# EAGLE design BBLeo_v1.1 (EAGLE 6.3)
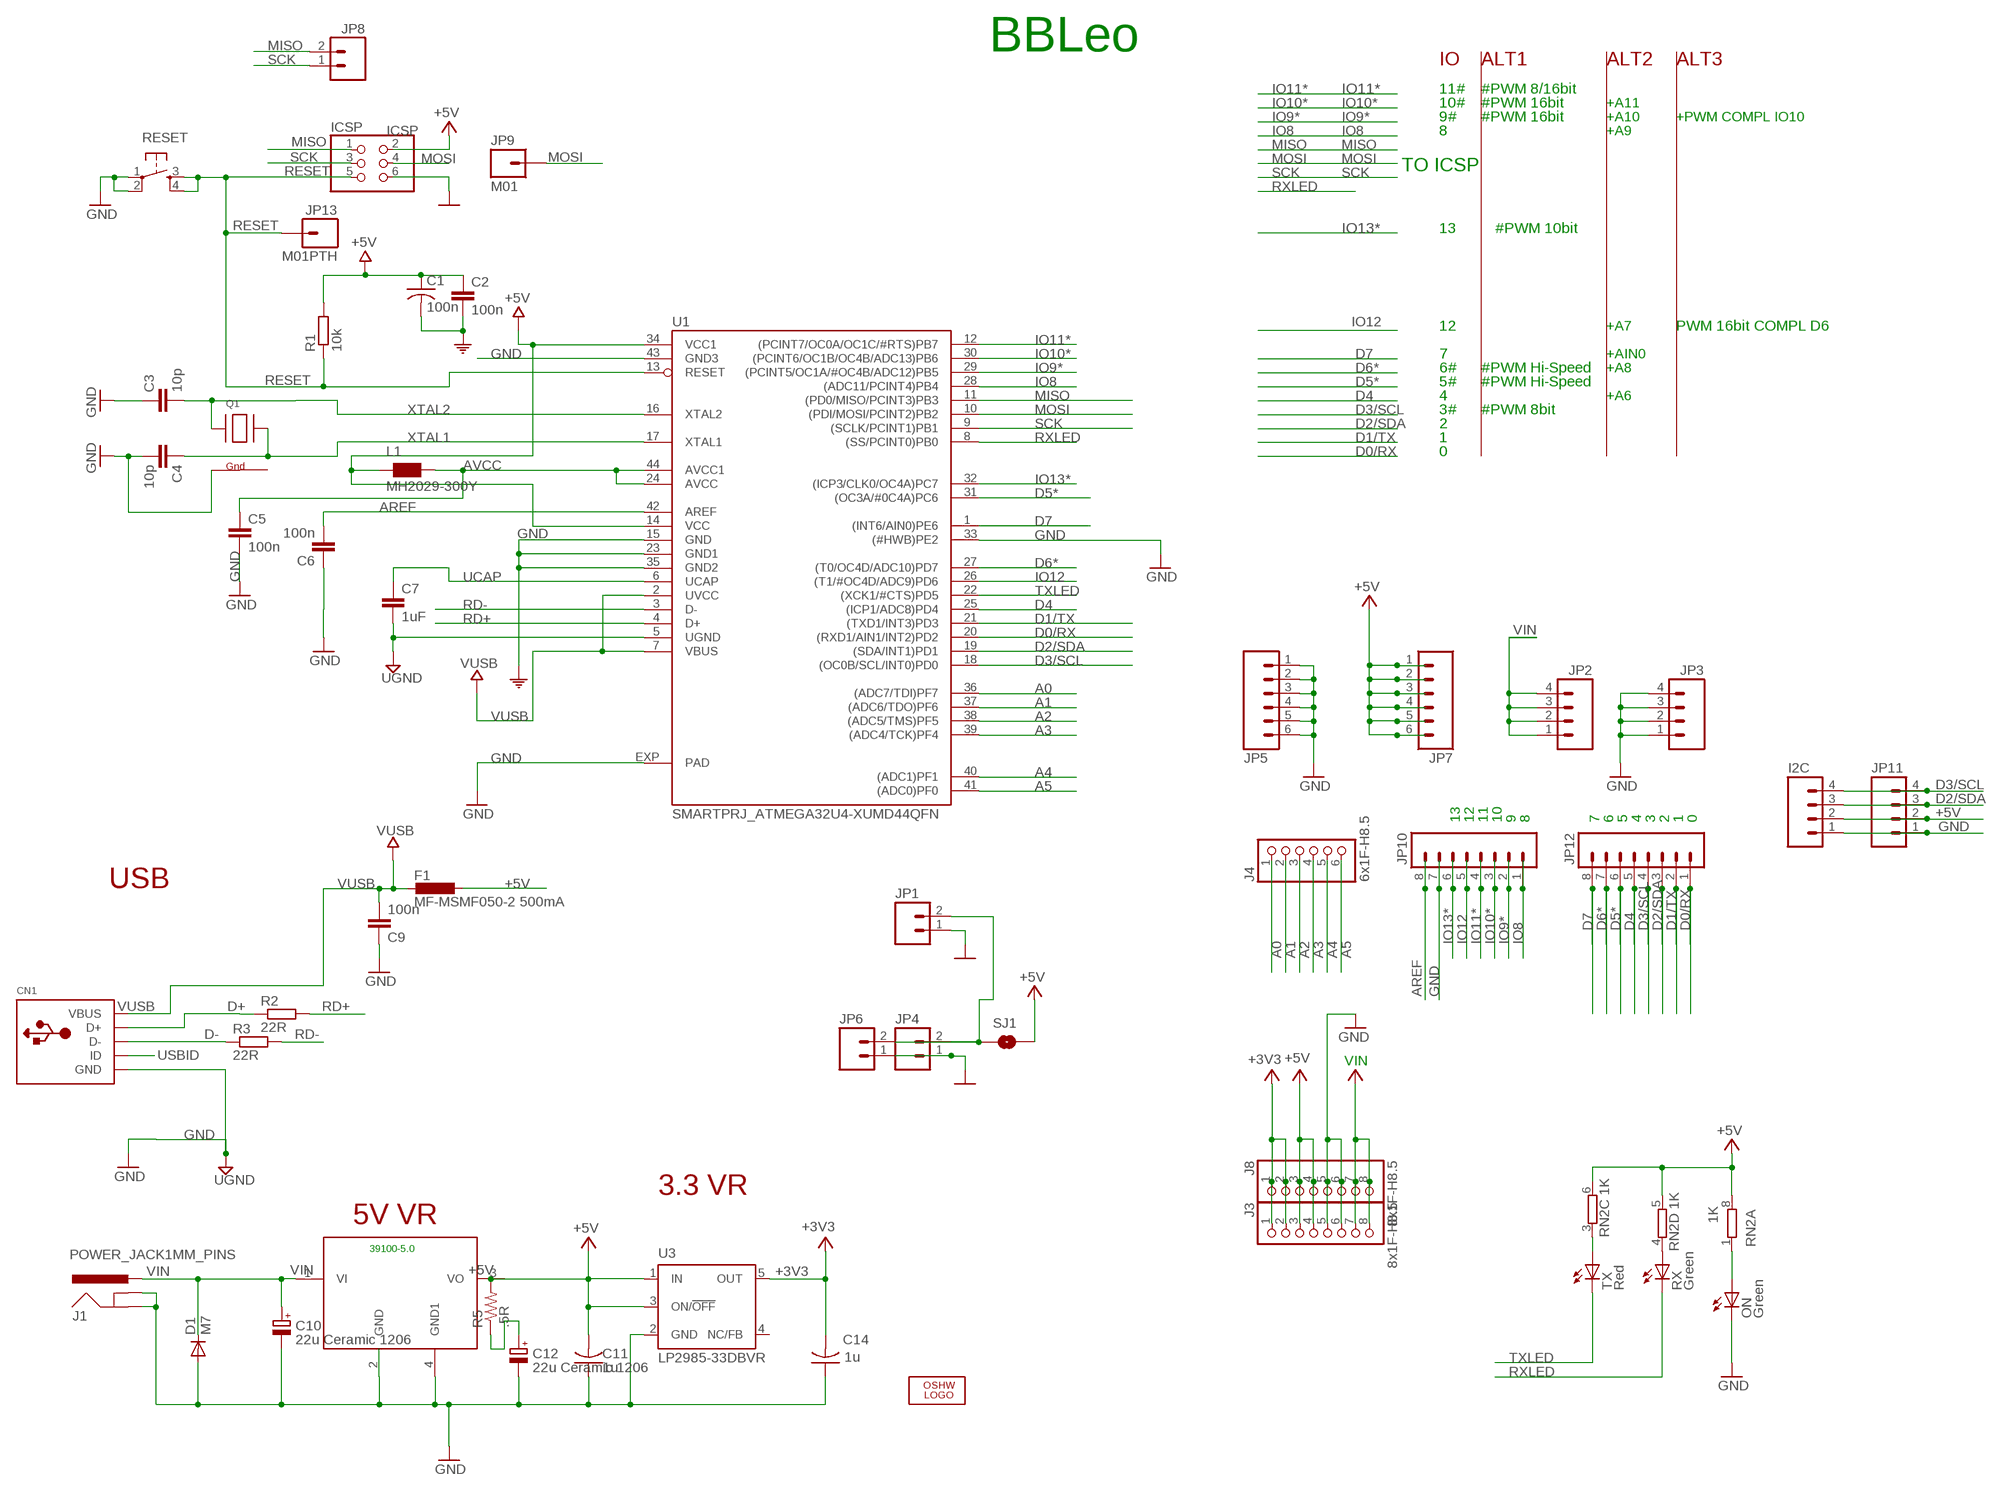
[diagram p0: schematic, sheet 1]

## Parts
C1  100n  C-USC0603K  [C0603K]
C2  100n  C-EUC0603  [C0603-ROUND]
C3  10p  C-EUC0603  [C0603-ROUND]
C4  10p  C-EUC0603  [C0603-ROUND]
C5  100n  C-EUC0603  [C0603-ROUND]
C6  100n  C-EUC0603  [C0603-ROUND]
C7  1uF  C-EUC0603  [C0603-ROUND]
C9  100n  C-EUC0603  [C0603-ROUND]
C10  22u Ceramic 1206  CPOL-EUSMCB  [SMC_B]
C11  1u  C-USC0603K  [C0603K]
C12  22u Ceramic 1206  CPOL-EUSMCB  [SMC_B]
C14  1u  C-USC0603K  [C0603K]
CN1  USBMINIB  [USB-MINIB]
D1  M7  DIODE-SMB  [SMB]
F1  MF-MSMF050-2 500mA  L-EUL1812  [L1812]
I2C  M04SQ_SILK  [1X04_SQ_SILK]
IC1  MIC39100DB  [SOT223WTAB]
ICSP  ICSP  PINHD-2X3  [2X03]
J1  POWER_JACK1MM_PINS  [POWER_JACK_1MMPTH.PAC]
J3  8x1F-H8.5  PINHD-1X8  [1X08]
J4  6x1F-H8.5  PINHD-1X6  [1X06]
J8  8x1F-H8.5  PINHD-1X8  [1X08]
JP1  M02PTH  [1X02]
JP2  M04SQ_SILK  [1X04_SQ_SILK]
JP3  M04SQ_SILK  [1X04_SQ_SILK]
JP4  M02PTH  [1X02]
JP5  M06SQ_SILK  [1X06_SQ_SILK]
JP6  M02PTH  [1X02]
JP7  M06SQ_SILK  [1X06_SQ_SILK]
JP8  M02PTH  [1X02]
JP9  M01  M01PTH  [1X01]
JP10  M08  [1X08]
JP11  M04SQ_SILK  [1X04_SQ_SILK]
JP12  M08  [1X08]
JP13  M01PTH  [1X01]
L1  MH2029-300Y  WE-CBF_0805  [0805]
LOGO1  OSHW_LOGO_FILLX0100-NT  [OSHW_FILLX100_NOTEXT]
ON  Green  LEDCHIPLED_0805  [CHIPLED_0805]
Q1  XTAL-4-3225  [NX3225]
R1  10k  R-EU_R0603  [R0603]
R2  22R  R-EU_R0603  [R0603]
R3  22R  R-EU_R0603  [R0603]
R5  .5R  R-US_R0603  [R0603]
RESET  6MM_SWITCH6MM_SWITCH  [6MM_SWITCH]
RN2  1K  4R-NCAY16  [CAY16]
RX  Green  LEDCHIPLED_0805  [CHIPLED_0805]
SJ1  SOLDERJUMPERNC2  [SJ_2S-NOTRACE]
TX  Red  LEDCHIPLED_0805  [CHIPLED_0805]
U1  SMARTPRJ_ATMEGA32U4-XUMD44QFN  [MD__QFN44ML7X7]
U3  LP2985-33DBVR  LP2985-XXDBVR33  [SOT23-DBV]

## Nets
+3V3: C14.2 J3.1 J3.2 J8.1 J8.2 U3.5(OUT)
+5V [usbvcc]: C1.1 C2.1 C11.2 F1.1 I2C.2 IC1.3(VO) ICSP.2 J3.3 J3.4 J8.3 J8.4 JP7.1 JP7.2 JP7.3 JP7.4 JP7.5 JP7.6 JP11.2 L1.1 R1.2 R5.2 RN2.5 RN2.6 RN2.8 SJ1.2 U1.14(VCC) U1.34(VCC1) U3.1(IN) U3.3(ON/!OFF)
A0: J4.1 U1.36((ADC7/TDI)PF7)
A1: J4.2 U1.37((ADC6/TDO)PF6)
A2: J4.3 U1.38((ADC5/TMS)PF5)
A3: J4.4 U1.39((ADC4/TCK)PF4)
A4: J4.5 U1.40((ADC1)PF1)
A5: J4.6 U1.41((ADC0)PF0)
AREF [aref]: C6.2 JP10.8 U1.42(AREF)
AVCC: C5.1 L1.2 U1.24(AVCC) U1.44(AVCC1)
D0/RX: JP12.1 U1.20((RXD1/AIN1/INT2)PD2)
D1/TX: JP12.2 U1.21((TXD1/INT3)PD3)
D2/SDA: I2C.3 JP11.3 JP12.3 U1.19((SDA/INT1)PD1)
D3/SCL: I2C.4 JP11.4 JP12.4 U1.18((OC0B/SCL/INT0)PD0)
D4: JP12.5 U1.25((ICP1/ADC8)PD4)
D5*: JP12.6 U1.31((OC3A/#0C4A)PC6)
D6*: JP12.7 U1.27((T0/OC4D/ADC10)PD7)
D7: JP12.8 U1.1((INT6/AIN0)PE6)
D+: CN1.D+ R2.1
D-: CN1.D- R3.1
GND [gnd]: C1.2 C2.2 C3.1 C4.2 C5.2 C6.1 C9.1 C10.- C11.1 C12.- C14.1 CN1.GND D1.A I2C.1 IC1.2(GND) IC1.4(GND1) ICSP.6 J1.GND J1.GNDBREAK J3.5 J3.6 J8.5 J8.6 JP1.1 JP3.1 JP3.2 JP3.3 JP3.4 JP4.1 JP5.1 JP5.2 JP5.3 JP5.4 JP5.5 JP5.6 JP6.1 JP10.7 JP11.1 ON.C Q1.4(G1) RESET.1(P) RESET.2(P1) U1.15(GND) U1.23(GND1) U1.33((#HWB)PE2) U1.35(GND2) U1.43(GND3) U1.EXP(PAD) U3.2(GND) ; supply symbol labelled , COM, UGND
GND1: C7.2 U1.5(UGND) ; supply symbol labelled UGND
IO8: JP10.1 U1.28((ADC11/PCINT4)PB4)
IO9*: JP10.2 U1.29((PCINT5/OC1A/#OC4B/ADC12)PB5)
IO10*: JP10.3 U1.30((PCINT6/OC1B/OC4B/ADC13)PB6)
IO11*: JP10.4 U1.12((PCINT7/OC0A/OC1C/#RTS)PB7)
IO12: JP10.5 U1.26((T1/#OC4D/ADC9)PD6)
IO13*: JP10.6 U1.32((ICP3/CLK0/OC4A)PC7)
MISO: ICSP.1 JP8.2 U1.11((PD0/MISO/PCINT3)PB3)
MOSI: ICSP.4 JP9.1 U1.10((PDI/MOSI/PCINT2)PB2)
N$2: RN2.3 TX.A
N$3: ON.A RN2.1
N$4: C12.+ R5.1
N$5: RN2.4 RX.A
RD+: R2.2 U1.4(D+)
RD-: R3.2 U1.3(D-)
RESET: ICSP.5 JP13.1 R1.1 RESET.3(S) RESET.4(S1) U1.13(RESET)
RXLED: RX.C U1.8((SS/PCINT0)PB0)
S5V: JP1.2 JP4.2 JP6.2 SJ1.1
SCK: ICSP.3 JP8.1 U1.9((SCLK/PCINT1)PB1)
TXLED: TX.C U1.22((XCK1/#CTS)PD5)
UCAP: C7.1 U1.6(UCAP)
USBID: CN1.ID
VIN [power]: C10.+ D1.C IC1.1(VI) J1.PWR J3.7 J3.8 J8.7 J8.8 JP2.1 JP2.2 JP2.3 JP2.4 ; supply symbol labelled V+
VUSB [power]: C9.2 CN1.VBUS F1.2 U1.2(UVCC) U1.7(VBUS)
XTAL1: C4.1 Q1.3(X2) U1.17(XTAL1)
XTAL2: C3.2 Q1.1(X1) U1.16(XTAL2)
Unconnected: RN2.2 RN2.7 U3.4(NC/FB)

## Notes on the sheet
- BBLeo
- IO | ALT1 | ALT2 | ALT3
- 11# | #PWM 8/16bit
- 10# | #PWM 16bit | +A11
- 9# | #PWM 16bit | +A10 | +PWM COMPL IO10
- 8 | +A9
- TO ICSP
- 13 | #PWM 10bit
- 12 | +A7 | PWM 16bit COMPL D6
- 7 | +AIN0
- 6# | #PWM Hi-Speed | +A8
- 5# | #PWM Hi-Speed
- 4 | +A6
- 3# | #PWM 8bit
- 2
- 1
- 0
- 13 | 12 | 11 | 10 | 9 | 8 | 7 | 6 | 5 | 4 | 3 | 2 | 1 | 0
- USB
- VIN
- 3.3 VR
- 5V VR
- 39100-5.0

## Power pins joined to a net without a drawn wire
G2: Q1.2(G2)

## Library data of the parts
C1 C11 C14 = ModernDevice:C-US: CAPACITOR, American symbol
C2-C7 C9 = SmartPrj:C-EU: CAPACITOR, European symbol
C10 C12 = rcl:CPOL-EU: POLARIZED CAPACITOR, European symbol
CN1 = adafruit:USB: USB Connectors USBMINIB - Surface Mount Female Mini-B USB Connector 4UConnector: 06564 By microbuilder.eu Thru-hole RA Female Mini-B USB Connector 4UConnector: 18732 By ladyada.net
D1 = diode:DIODE-: DIODE
F1 = rcl:L-EU: INDUCTOR, European symbol
I2C JP2 JP3 JP11 = ModernDevice:M04: Header 4 Standard 4-pin 0.1" header. Use with straight break away headers (SKU : PRT-00116), right angle break away headers (PRT-00553), swiss pins (PRT-00743), machine pins (PRT-00117), and female headers (PRT-00115). Molex polarized connector foot print use with SKU : PRT-08231 with associated crimp pins and housings.
IC1 = ModernDevice:MIC39100DB: Micrel 1A LDO SOT223 package
ICSP = ModernDevice:PINHD-2X3: PIN HEADER
J1 = ModernDevice:POWER_JACK: Power Jack This is the standard 5.5mm barrel jack for power. The PTH is the most common, proven, reliable, footprint. All others are experimental. The Slot footprint only works if the mill layer is transmitted to the PCB fab house so be warned. Spark Fun Electronics SKU : PRT-00119. Mating wall wart : TOL-00298 (and others)
J3 J8 = SmartPrj:PINHD-1X8: PIN HEADER
J4 = SmartPrj:PINHD-1X6: PIN HEADER
JP1 JP4 JP6 JP8 = ModernDevice:M02: Header 2 Standard 2-pin 0.1" header. Use with straight break away headers (SKU : PRT-00116), right angle break away headers (PRT-00553), swiss pins (PRT-00743), machine pins (PRT-00117), and female headers (PRT-00115). Molex polarized connector foot print use with SKU : PRT-08233 with associated crimp pins and housings.
JP5 JP7 = ModernDevice:M06: Header 6 Standard 6-pin 0.1" header. Use with straight break away headers (SKU : PRT-00116), right angle break away headers (PRT-00553), swiss pins (PRT-00743), machine pins (PRT-00117), and female headers (PRT-00115). Molex polarized connector foot print use with SKU : PRT-08094 with associated crimp pins and housings. NOTES ON THE VARIANTS LOCK and LOCK_LONGPADS... This footprint was designed to help hold the alignment of a through-hole component (i.e. 6-pin header) while soldering it into place. You may notice that each hole has been shifted either up or down by 0.005 of an inch from it's more standard position (which is a perfectly straight line). This slight alteration caused the pins (the squares in the middle) to touch the edges of the holes. Because they are alternating, it causes a "brace" to hold the component in place. 0.005 has proven to be the perfect amount of "off-center" position when using our standard breakaway headers. Although looks a little odd when you look at the bare footprint, once you have a header in there, the alteration is very hard to notice. Also, if you push a header all the way into place, it is covered up entirely on the bottom side. This idea of altering the position of holes to aid alignment will be further integrated into the Sparkfun Library for other footprints. It can help hold any component with 3 or more connection pins.
JP9 JP13 = ModernDevice:M01: Header 1 Standard 1-pin 0.1" header. Use with straight break away headers (SKU : PRT-00116), right angle break away headers (PRT-00553), swiss pins (PRT-00743), machine pins (PRT-00117), and female headers (PRT-00115).
JP10 JP12 = ModernDevice:M08: Header 8 Standard 8-pin 0.1" header. Use with straight break away headers (SKU : PRT-00116), right angle break away headers (PRT-00553), swiss pins (PRT-00743), machine pins (PRT-00117), and female headers (PRT-00115).
L1 = wuerth-elektronik:WE-CBF: SMD EMI Suppression Ferrite Beads - excellent anti-EMI properties - low DCR - impedances till 3000 ohms - rated current up to 6 A
LOGO1 = ohw-logo:OSHW_LOGO_FILL
ON RX TX = led:LED: LED OSRAM: - CHIPLED LG R971, LG N971, LY N971, LG Q971, LY Q971, LO R971, LY R971 LH N974, LH R974 LS Q976, LO Q976, LY Q976 LO Q996 - Hyper CHIPLED LW Q18S LB Q993, LB Q99A, LB R99A - SideLED LS A670, LO A670, LY A670, LG A670, LP A670 LB A673, LV A673, LT A673, LW A673 LH A674 LY A675 LS A676, LA A676, LO A676, LY A676, LW A676 LS A679, LY A679, LG A679 - Hyper Micro SIDELED® LS Y876, LA Y876, LO Y876, LY Y876 LT Y87S - SmartLED LW L88C, LW L88S LB L89C, LB L89S, LG L890 LS L89K, LO L89K, LY L89K LS L896, LA L896, LO L896, LY L896 - TOPLED LS T670, LO T670, LY T670, LG T670, LP T670 LSG T670, LSP T670, LSY T670, LOP T670, LYG T670 LG T671, LOG T671, LSG T671 LB T673, LV T673, LT T673, LW T673 LH T674 LS T676, LA T676, LO T676, LY T676, LB T676, LH T676, LSB T676, LW T676 LB T67C, LV T67C, LT T67C, LS T67K, LO T67K, LY T67K, LW E67C LS E67B, LA E67B, LO E67B, LY E67B, LB E67C, LV E67C, LT E67C LW T67C LS T679, LY T679, LG T679 LS T770, LO T770, LY T770, LG T770, LP T770 LB T773, LV T773, LT T773, LW T773 LH T774 LS E675, LA E675, LY E675, LS T675 LS T776, LA T776, LO T776, LY T776, LB T776 LHGB T686 LT T68C, LB T68C - Hyper Mini TOPLED® LB M676 - Mini TOPLED Santana® LG M470 LS M47K, LO M47K, LY M47K Source: http://www.osram.convergy.de LUXEON: - LUMILED® LXK2-PW12-R00, LXK2-PW12-S00, LXK2-PW14-U00, LXK2-PW14-V00 LXK2-PM12-R00, LXK2-PM12-S00, LXK2-PM14-U00 LXK2-PE12-Q00, LXK2-PE12-R00, LXK2-PE12-S00, LXK2-PE14-T00, LXK2-PE14-U00 LXK2-PB12-K00, LXK2-PB12-L00, LXK2-PB12-M00, LXK2-PB14-N00, LXK2-PB14-P00, LXK2-PB14-Q00 LXK2-PR12-L00, LXK2-PR12-M00, LXK2-PR14-Q00, LXK2-PR14-R00 LXK2-PD12-Q00, LXK2-PD12-R00, LXK2-PD12-S00 LXK2-PH12-R00, LXK2-PH12-S00 LXK2-PL12-P00, LXK2-PL12-Q00, LXK2-PL12-R00 Source: www.luxeon.com KINGBRIGHT: KA-3528ASYC Source: www.kingbright.com
Q1 = ModernDevice:XTAL-4: Classic 4-pin 3.2 x 2.5mm crystal
R1-R3 = rcl:R-EU_: RESISTOR, European symbol
R5 = ModernDevice:R-US_: RESISTOR, American symbol
RESET = ModernDevice:6MM_SWITCH: OMRON SWITCH
RN2 = resistor-dil:4R-N: Array Chip Resistor Source: RS Component / Phycomp; OC_FARNELL: unknown; OC_NEWARK: unknown
SJ1 = ModernDevice:SOLDERJUMPER: Solder Jumper Standard SMD solder jumper. Used to automate production. Two varients : Normally Open and Normally Closed are the same, but have different paste layers. NC will have a large amount of paste and should jumper during reflow.
U1 = ModernDevice:SMARTPRJ_ATMEGA32U4-XU
U3 = SmartPrj:LP2985-XXDBVR: ULTRALOW-POWER 50-mA LOW-DROPOUT LINEAR REGULATORS 50-mA Low-Dropout Regulator Source: http://focus.ti.com/lit/ds/symlink/tps77001.pdf

## Net classes
0 default: width 0.203 mm, drill 0.254 mm, clearance 0.203 mm
1 power: width 0.203 mm, drill 0.508 mm, clearance 0.254 mm
2 gnd: width 0.203 mm, drill 0.508 mm, clearance 0.203 mm
3 usbvcc: width 0.203 mm, drill 0.508 mm, clearance 0.254 mm
4 aref: width 0.203 mm, drill 0.254 mm, clearance 0.254 mm

## Board
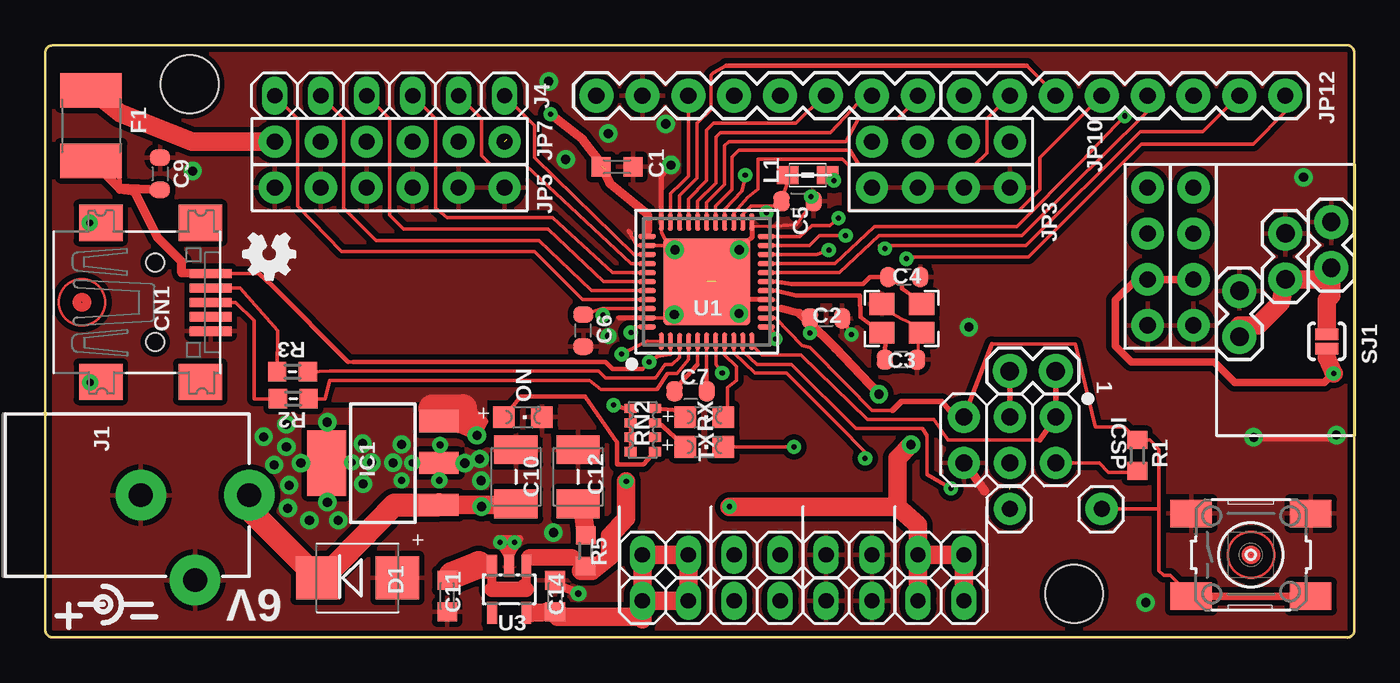
[diagram p1: board, top side]
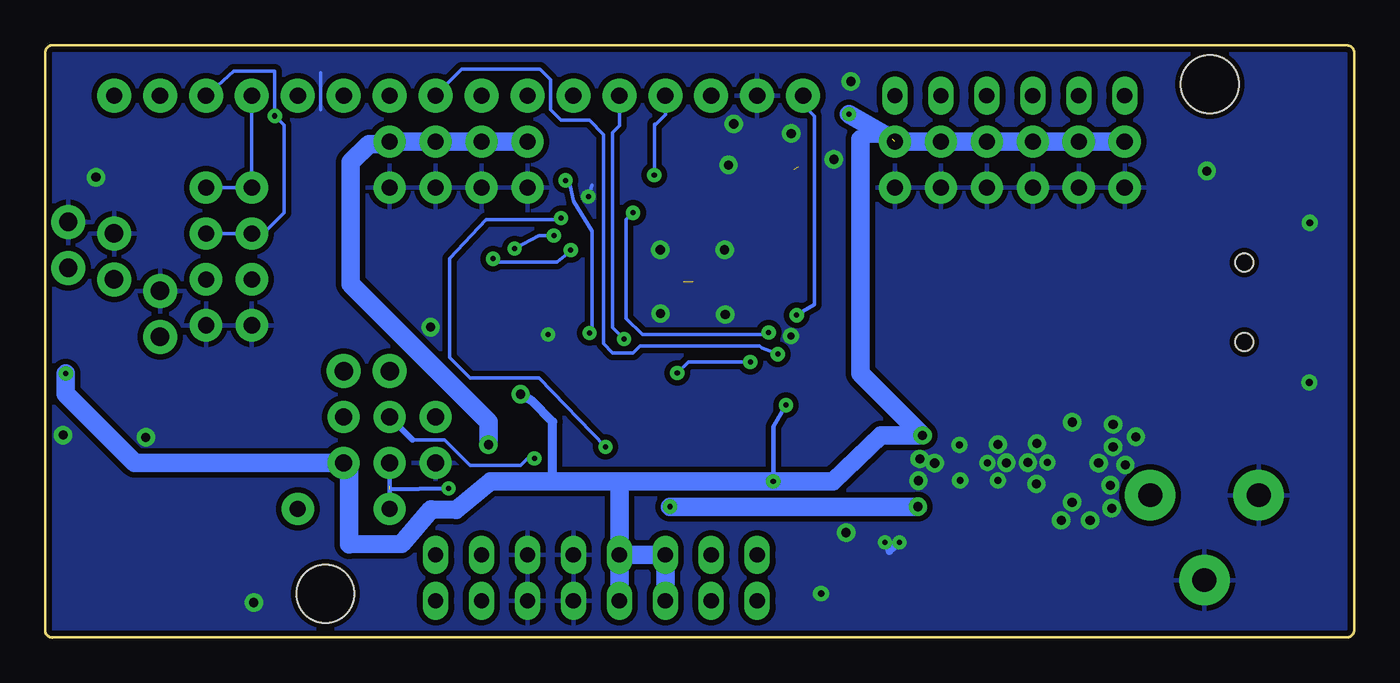
[diagram p2: board, bottom side, seen from below]

Size 72.39 x 32.77 mm. Coordinates in mm from the lower left corner, seen from the top.
Outline: 71.96,32.77 0.46,32.75 arc90 0,32.39 0,0.42 arc90 0.42,0 71.96,0 arc90 72.39,0.36 72.39,32.36 arc90 71.96,32.77
Outline: 71.96,32.77 71.75,32.77
Copper layers (1*16): Top 0.035mm / dielectric 1.5mm / Bottom 0.035mm
Design rules "default": minimum track width 8mil, minimum drill 10mil, track to track 7mil, track to pad 7mil, pad to pad 7mil, via to via 7mil, smd to smd 7mil, copper to edge 10mil, drill to drill 12mil, minimum pad ring 10mil, minimum via ring 10mil, stop-mask expansion 2mil, vias tented up to drill 26mil, thermal gap 12mil
Holes 3.2 mm at 7.99,30.61 56.9,2.41
tRestrict: area 41.3,23.4 to 41.8,26; area 47.1,15 to 47.6,20.4; area 34,17.1 to 39.1,22.2
vRestrict: area 47.9,9.8 to 48.5,10.3; area 50.4,9.7 to 50.9,10.5

### Footprints (pad centres in the part's own frame; a part is rotated, then mirrored left to right if it is on the bottom)
C0603K = smd 1.05 x 1.08: 1 -0.875,0; 2 0.875,0
C0603-ROUND = smd 0.898 x 1.1: 1 -0.889,0; 2 0.889,0
SMC_B = smd 1.6 x 2.4: + -1.5,0; - 1.5,0
USB-MINIB = smd 0.5 x 2.308: D+ 0,4.064; D- -0.8,4.064; GND 1.6,4.064; ID 0.8,4.064; VBUS -1.6,4.064 | smd 2 x 2.4: GND1 -4.4,-2; GND2 -4.4,3.5; GND3 4.4,3.5; GND4 4.4,-2 | hole 1: -2.2,1; 2.2,1
SMB = smd 2.4 x 2.4: A 2.2,0; C -2.2,0
L1812 = smd 1.9 x 3.4: 1 -1.95,0; 2 1.95,0
1X04_SQ_SILK = drill 0.889 pad 1.778: 1 -3.81,0; 2 -1.27,0; 3 1.27,0; 4 3.81,0
SOT223WTAB = smd 1.219 x 2.235: 1 -2.311,-3.099; 2 0,-3.099; 3 2.311,-3.099 | smd 3.6 x 2.2: 4 0,3.099
2X03 = drill 0.94 pad 1.778: 1 -2.54,-1.27; 2 -2.54,1.27; 3 0,-1.27; 4 0,1.27; 5 2.54,-1.27; 6 2.54,1.27
POWER_JACK_1MMPTH.PAC = drill 1.321 pad 2.794: GND 0,7.7; GNDBREAK 4.7,10.7; PWR 0,13.7
1X08 = drill 0.85 pad 1.422 long: 1 -8.89,0; 2 -6.35,0; 3 -3.81,0; 4 -1.27,0; 5 1.27,0; 6 3.81,0; 7 6.35,0; 8 8.89,0
1X06 = drill 0.85 pad 1.422 long: 1 -6.35,0; 2 -3.81,0; 3 -1.27,0; 4 1.27,0; 5 3.81,0; 6 6.35,0
1X02 = drill 1.016 pad 1.88: 1 0,0; 2 2.54,0
1X06_SQ_SILK = drill 0.889 pad 1.778: 1 -6.35,0; 2 -3.81,0; 3 -1.27,0; 4 1.27,0; 5 3.81,0; 6 6.35,0
1X01 = drill 0.889 pad 1.778: 1 0,0
1X08' = drill 0.9 pad 1.88: 1 0,0; 2 2.54,0; 3 5.08,0; 4 7.62,0; 5 10.16,0; 6 12.7,0; 7 15.24,0; 8 17.78,0
0805 = smd 1.2 x 1: 1 -1.1,0; 2 1.1,0
CHIPLED_0805 = smd 1.2 x 1.2: A 0,-1.05; C 0,1.05
NX3225 = smd 1.4 x 1.2: 1 -1.1,-0.8; 2 1.1,-0.8; 3 1.1,0.8; 4 -1.1,0.8
R0603 = smd 1 x 1.1: 1 -0.85,0; 2 0.85,0
6MM_SWITCH = smd 2.286 x 1.524: 1 -3.302,2.286; 2 3.302,2.286; 3 -3.302,-2.286; 4 3.302,-2.286
CAY16 = smd 0.5 x 0.65: 1 -1.2,-0.675; 2 -0.4,-0.675; 3 0.4,-0.675; 4 1.2,-0.675; 5 1.2,0.675; 6 0.4,0.675; 7 -0.4,0.675; 8 -1.2,0.675
SJ_2S-NOTRACE = smd 0.635 x 1.27: 1 -0.401,0; 2 0.413,0
MD__QFN44ML7X7 = smd 0.95 x 0.275: 1 -3.3,2.5; 2 -3.3,2; 3 -3.325,1.5; 4 -3.325,1; 5 -3.3,0.5; 6 -3.3,0; 7 -3.3,-0.5; 8 -3.3,-1; 9 -3.3,-1.5; 10 -3.3,-2; 11 -3.3,-2.5; 23 3.3,-2.5; 24 3.3,-2; 25 3.3,-1.5; 26 3.3,-1; 27 3.3,-0.5; 28 3.3,0; 29 3.3,0.5; 30 3.3,1; 31 3.3,1.5; 32 3.3,2; 33 3.3,2.5 | smd 0.275 x 0.95: 12 -2.5,-3.3; 13 -2,-3.3; 14 -1.5,-3.3; 15 -1,-3.3; 16 -0.5,-3.3; 17 0,-3.3; 18 0.5,-3.3; 19 1,-3.3; 20 1.5,-3.3; 21 2,-3.3; 22 2.5,-3.3; 34 2.5,3.3; 35 2,3.3; 36 1.5,3.3; 37 1,3.3; 38 0.5,3.3; 39 0,3.3; 40 -0.5,3.3; 41 -1,3.3; 42 -1.5,3.3; 43 -2,3.3; 44 -2.5,3.3 | smd 4.826 x 4.826: EXP 0,0
SOT23-DBV = smd 0.55 x 1.2: 1 -0.95,-1.3; 2 0,-1.3; 3 0.95,-1.3; 4 0.95,1.3; 5 -0.95,1.3

### Placement (x,y rotation side)
C1  31.62,26.04 0 top
C2  43.18,17.65 0 top
C3  47.32,15.37 180 top
C4  47.5,19.94 0 top
C5  41.61,24.13 0 top
C6  29.76,16.98 90 top
C7  35.69,13.62 180 top
C9  6.35,25.66 270 top
C10  26.04,8.89 90 top
C11  22.23,2.29 90 top
C12  29.46,8.89 90 top
C14  28.19,2.29 270 top
CN1  5.08,18.54 270 top
D1  17.27,3.3 0 top
F1  2.54,28.32 270 top
I2C  60.96,21.08 90 top
IC1  18.67,9.65 90 top
ICSP  53.34,10.92 180 top
J1  -2.41,7.88 270 top
J3  41.91,2.03 0 top
J4  19.05,29.97 180 top
J8  41.91,4.57 0 top
JP1  66.04,19.18 270 top
JP2  49.53,27.43 0 top
JP3  49.53,24.89 0 top
JP4  71.12,22.99 270 top
JP5  19.05,24.89 0 top
JP6  68.58,22.35 270 top
JP7  19.05,27.43 0 top
JP8  53.34,14.73 0 top
JP9  53.34,7.11 0 top
JP10  [1X08']  48.26,29.97 180 top
JP11  63.5,21.08 90 top
JP12  [1X08']  68.58,29.97 180 top
JP13  58.42,7.11 0 top
L1  42.16,25.58 180 top
LOGO1  13.8,22.34 180 top
ON  26.42,12.19 270 top
Q1  47.37,17.65 0 top
R1  60.39,10.07 270 top
R2  13.72,13.21 0 top
R3  13.68,14.7 0 top
R5  29.9,4.8 270 top
RESET  66.67,4.57 0 top
RN2  33.05,11.48 90 top
RST  [FIDUCIAL]  66.67,4.57 0 top
RX  36.45,12.19 270 top
SJ1  70.87,16.38 270 top
TX  36.45,10.54 270 top
U1  36.58,19.69 90 top
U3  25.65,2.67 180 top
U$2  [FIDUCIAL]  2.03,18.54 0 top

### Tracks (layer width: path | path; a pad name or v marks a point on that pad's centre or on a via)
+3V3
  Top 0.406: U3.5 26.89,1.37 | 33.02,1.91 J3.1
  Top 1.016: 26.89,1.37 C14.2 28.32,1.41 28.32,1.14 33.02,1.14 | 33.02,1.02 33.02,1.14 | 33.02,1.14 33.02,1.91 J8.1 J8.2 | J3.1 J3.2 35.56,4.7
+5V  (via drill 0.28 pad 0.56, 0.51 pad 1.02)  (2 unrouted)
  Top 0.152: 29.63,3.68 R5.2
  Top 0.203: U1.14 40.7,18.19 | L1.1 43.1,25.49 43.92,25.19 v43.61,25.29 | v42.29,16.84 C2.1 | 70.77,15.88 SJ1.2 | ICSP.2 58.29,9.65 58.8,9.15 60.31,9.15 R1.2 | RN2.5 RN2.6 RN2.8
  Top 0.254: 42.16,17.53 C2.1 | v31.43,12.85 32.39,12.57 RN2.5 | 33.3,22.48 33.3,22.21 U1.34
  Top 0.406: 40.7,18.19 41.69,17.95 | 70.87,15.5 SJ1.2 | 24.7,2.73 24.71,2.67 | I2C.2 JP11.2 60.33,19.81 59.18,18.67 59.18,16.13 60.07,15.24 64.64,15.24 65.79,14.1 70.74,14.1 v71.25,14.61 | v23.88,11.18 24.3,11.95 23.43,12.69 | 22.91,11.7 23.11,12.7 | 21.4,12.68 IC1.3
  Top 0.508: 41.69,17.95 42.16,17.53 43.69,16 v46.1,13.46 | v27.94,28.96 29.72,27.56 29.72,27.55 30.99,25.91 | C1.1 31.23,25.11 33.3,23.42 33.3,22.48 | 26.78,4.45 26.6,4.13 U3.1 26.58,2.99 26.48,2.88 26.48,2.86 | 24.7,2.73 U3.3 24.64,3.9 24.64,3.68 24.69,3.51 24.21,3.51 23.95,4.01 | 22.52,3.43 C11.2 | 29.12,4.45 R5.2
  Top 0.762: 26.48,2.86 26.59,2.67 | 23.43,12.69 23.79,11.33 22.91,11.7
  Top 0.864: 26.59,2.67 24.71,2.67
  Top 0.914: 26.78,4.45 29.12,4.45
  Top 1.016: v71.25,14.61 70.87,15.5 | F1.1 4.15,29 8.13,27.43 JP7.1 | v32.13,8.64 32.13,6.61 31.24,5.63 31.24,4.48 30.23,3.68 29.63,3.68
  Top 1.524: 23.95,4.01 22.52,3.43 | 23.11,12.7 21.4,12.68
  Bottom 0.203: v43.61,25.29 43.43,25.27 43.18,24.13 42.16,22.48 42.16,17.27 | 42.16,17.15 42.16,17.27 | 42.16,17.27 v42.29,16.84 | 40.64,8.64 43.31,8.64 44.32,8.38 | 55.58,9.15 55.5,9.27 ICSP.2
  Bottom 0.254: v32.13,8.64 32.13,11.69 v31.43,12.85
  Bottom 0.406: 25.53,27.56 27.3,27.56
  Bottom 0.508: 44.32,8.38 44.32,11.94 45.47,13.08 v46.1,13.46
  Bottom 1.016: 40.64,8.64 v32.13,8.64 28.83,8.64 26.16,11.18 v23.88,11.18 27.3,14.61 27.3,27.56 | 40.64,8.64 47.75,8.64 49.68,7.08 51.05,7.09 52.68,5.17 55.58,5.16 55.58,9.15 | ICSP.2 67.44,9.65 71.25,13.46 v71.25,14.61 | J3.4 J8.4 | J8.4 40.64,8.64 | J3.3 J8.3 J8.4 | v27.94,28.96 25.53,27.56 | JP7.6 JP7.5 JP7.4 JP7.3 JP7.2 JP7.1
  pour Top: 16.12,13.84 15.88,13.08 20.83,13.08 20.83,11.94 24.38,11.94 24.38,13.21 25.53,13.21 26.15,13.84
A0
  Top 0.203: U1.36 32.56,21.19 27.05,26.54 27.05,28.32 J4.1
A1
  Top 0.203: U1.37 32.4,20.69 26.54,26.16 24.64,26.16 24.13,26.67 24.13,28.7 J4.2
A2
  Top 0.203: U1.38 31.38,20.19 28.07,23.24 22.23,23.24 21.59,23.75 21.59,28.7 J4.3
A3
  Top 0.203: U1.39 30.86,19.69 27.81,22.61 19.81,22.61 19.05,23.37 19.05,28.7 J4.4
A4
  Top 0.203: U1.40 30.22,19.19 27.3,21.97 18.29,21.97 16.51,23.75 16.51,28.7 J4.5
A5
  Top 0.203: U1.41 29.7,18.69 27.05,21.34 16.38,21.34 13.97,23.88 13.97,28.7 J4.6
AREF  (via drill 0.28 pad 0.56)
  Top 0.203: 30.82,18.19 C6.2 | U1.42 30.82,18.19 | 30.82,18.19 30.82,17.81 v30.84,17.83
  Bottom 0.203: v30.84,17.83 29.84,18.42 29.84,28.83 30.48,29.47 JP10.8
AVCC  (via drill 0.28 pad 0.56)
  Top 0.203: L1.2 41.07,25.28 C5.1 40.87,23.88 39.83,23.88 | U1.24 38.59,23.43 39.03,23.88 39.83,23.88 | U1.44 32.46,17.19 v32.38,16.88 | v39.88,23.5 39.83,23.88
  Bottom 0.203: v32.38,16.88 32.54,16.77 39.37,16.77 40.26,17.65 40.26,23.12 v39.88,23.5
D0/RX  (via drill 0.28 pad 0.56)
  Top 0.203: U1.20 42.65,21.19 v43.33,21.44 | v47.62,20.96 47.97,20.96 48.01,21.05 54.36,21.05 60.62,27.31 66.8,27.31 68.58,29.08 JP12.1
  Bottom 0.203: v43.33,21.44 43.31,21.46 | 43.31,21.46 43.38,21.46 | 43.31,21.46 43.23,21.46 44.09,20.77 47.4,20.77 v47.62,20.96
D1/TX  (via drill 0.28 pad 0.56)
  Top 0.203: U1.21 42.26,21.69 42.81,22.23 43.95,22.23 v44.26,22.24 | v46.43,21.52 46.23,21.46 46.14,21.69 54.22,21.69 60.57,27.98 64.02,27.99 66,29.97 JP12.2
  Bottom 0.203: v44.26,22.24 45.09,22.23 v46.43,21.52
D2/SDA  (via drill 0.28 pad 0.56)
  Top 0.203: U1.19 43.67,20.69 45.85,22.73 53.72,22.73 57.28,26.29 v59.69,28.86
  Bottom 0.203: v59.69,28.86 59.69,31.33 61.98,31.33 63.46,29.97 JP12.3 | v59.69,28.86 59.69,28.83 59.18,28.35 59.18,23.5 60.33,22.35 I2C.3 JP11.3 | 59.84,28.7 v59.69,28.86
D3/SCL
  Top 0.203: U1.18 43.93,20.19 46.1,22.23 54.01,22.23 54.62,22.84 60.72,28.88 60.96,29.12 JP12.4
  Bottom 0.203: JP11.4 I2C.4 JP12.4
D4
  Top 0.203: U1.25 38.08,23.47 38.86,24.37 39.42,24.82 39.42,26.47 44.09,26.47 44.45,26.11 44.45,23.62 53.85,23.62 54.99,24.77 54.99,26.54 JP12.5
D5*
  Top 0.203: 37.64,31.62 36.96,31.24 36.83,31.12 36.83,29.21 36.04,28.45 36.04,25.4 35.08,24.46 U1.31 | JP12.6 55.88,30.02 54.28,31.62
  Top 0.254: 37.64,31.62 54.28,31.62
D6*
  Top 0.203: U1.27 37.08,23.87 37.97,24.77 37.97,26.57 38.35,26.95 44.51,26.95 44.98,26.18 44.98,26.16 51.4,26.16 52.07,26.8 52.07,28.7 JP12.7
D7  (via drill 0.28 pad 0.56)
  Top 0.203: U1.1 33.3,16.41 v31.88,15.67
  Bottom 0.203: v31.88,15.67 32.77,16 32.89,16.13 39.5,16.13 39.88,15.75 41.02,15.75 41.53,16.26 41.53,27.81 42.28,28.63 43.87,28.63 44.45,29.21 44.45,30.86 45.02,31.45 49.38,31.45 50.7,30.13 JP12.8
D+
  Top 0.203: R2.1 11.56,13.21 11.56,17.53 10.54,18.54 CN1.D+
D-
  Top 0.203: R3.1 12.87,16.98 10.78,19.34 8.79,19.34 CN1.D-
GND  (via drill 0.28 pad 0.56, 0.36 pad 0.71, 0.38 pad 0.56, 0.38 pad 0.76, 0.51 pad 0.56, 0.51 pad 1.02)  (1 unrouted)
  Top 0.152: 39.04,22.84 39.09,22.81 39.08,22.71 | 39.04,22.93 U1.23 | Q1.4 46.51,18.11 47.36,17.64 48.01,17.34 48.26,17.02 48.26,15.47 C3.1 | U1.33 34.07,22.96 U1.33
  Top 0.203: U1.23 39.07,22.76 | 39.07,22.76 39.98,22.73 41.55,22.84 C5.2 v42.35,24.39 | C2.2 v44.58,16.77 | 38.1,18.69 37.58,18.69 v38.37,17.92 | v34.78,17.87 34.8,18.04 34.8,17.78 34.7,17.69 U1.43 33.15,17.69 | U1.33 34.08,22.43 34.45,21.69 U1.35 33.02,21.69 32.84,21.69 32.69,21.72 32.31,22.4 | 39.07,22.76 39.09,22.76 | 38.66,21.82 38.66,21.77 | 39.04,22.84 39.04,22.93 | 34.08,25.45 v34.61,26.14
  Top 0.254: 32.31,22.4 32.38,22.35 32.26,22.48
  Top 0.279: U1.15 38.1,18.69 | 39.08,22.71 39.08,22.12 38.66,21.82 | U1.33 34.08,25.45 | 33.15,17.69 31.73,17.69
  Top 0.381: 34.45,21.69 v34.82,21.45 | 38.66,21.77 v38.38,21.45
  Top 0.406: 25.13,5.23 v25.16,5.27 | U3.2 25.74,4.55 26.23,5.45 25.07,5.46 25.07,5.31 25.67,4.34 25.67,4.95 25.41,4.83 25.41,4.95 25.15,5.21 | 37.1,19.69 38.1,18.69 | 66.93,11.05 71.37,11.05 71.5,11.18
  Top 0.508: C14.1 28.39,2.91 v29.49,2.44 | 51.96,8.09 50.8,9.78
  Bottom 0.203: v42.35,24.39 42.16,25.02 | v44.58,16.77 44.7,16.64 | 57.15,31.24 57.15,29.21
  Bottom 0.381: v38.37,17.92 38.3,18.25
  Bottom 0.406: v25.16,5.27 25.67,4.83 | v25.96,5.27 25.81,5.39 25.72,4.78
  other vias: 13.34,11.79 28.78,26.46 14.14,9.65 13.41,7.15 15.61,7.48 23.2,9.64 24.1,8.68 21.79,8.7 20.29,9.65 21.83,10.64 28.11,5.81 66.83,11.08 51.08,17.17 71.4,11.2 17.55,10.73 16.98,9.68 17.58,8.5 8.15,25.81 15.6,11.91 69.58,25.47 24.03,9.88 13.34,10.54 14.61,6.48 16.21,6.48 12.08,11.1 18.05,9.68 19.71,10.68 19.71,8.7 19.24,9.67 34.32,28.41 31.14,27.88 31.14,16.68 60.86,1.93 27.84,30.76 2.46,22.94 2.5,14.1 12.66,9.55 13.49,8.42
  pour Bottom (isolate 0.305, rank 2): -1.27,33.78 73.66,33.78 73.66,-1.78 -1.27,-1.78
  pour Top (isolate 0.305, rank 2): -2.54,35.05 -2.54,-3.05 74.93,-3.05 74.93,35.05
GND1
  Top 0.203: U1.5 36.07,15.11
  Top 0.254: 36.07,15.11 34.8,13.72 C7.2
IO8
  Top 0.203: U1.28 36.58,24.06 37.57,25.05 37.57,27.2 37.82,27.43 44.28,27.43 44.98,28.7 47.13,28.7 48.26,29.83 JP10.1
IO9*
  Top 0.203: U1.29 36.08,24.14 37.08,25.15 37.08,27.69 37.34,27.94 43.43,27.94 44.96,29.59 45.34,29.97 JP10.2
IO10*
  Top 0.203: U1.30 35.58,24.26 36.58,25.27 36.58,28.07 36.96,28.45 41.53,28.45 43.05,29.97 JP10.3
IO11*  (via drill 0.28 pad 0.56)
  Top 0.254: U1.12 40.09,17.19 v40.39,16.51
  Bottom 0.203: JP10.4 40.64,28.32 41.02,27.94 41.02,17.15 v40.39,16.51
  Bottom 0.254: 40.64,16.51 v40.39,16.51
IO12  (via drill 0.28 pad 0.56)
  Top 0.203: U1.26 37.58,23.68 38.53,24.69 38.73,25.53 v38.71,25.58 38.73,25.55
  Bottom 0.203: v38.71,25.58 38.71,28.32 | 38.71,28.32 38.71,28.4 | JP10.5 38.1,28.93 38.71,28.32
IO13*
  Top 0.203: U1.32 34.58,24.54 35.18,25.15 35.56,25.53 JP10.6
MISO
  Top 0.203: 39.08,16.17 39.62,15.62 41.78,15.62 45.47,12.07 49.15,12.07 49.91,10.92 54.99,10.92
  Top 0.254: U1.11 39.08,16.17
  Top 0.305: 54.99,10.92 ICSP.1 JP8.2
MOSI  (via drill 0.28 pad 0.56)  (1 unrouted)
  Top 0.203: U1.10 38.58,15.83 39.37,15.11 41.27,15.11 44.83,11.56 48.51,11.56 48.77,11.18 48.77,9.02 v50.09,8.26
  Bottom 0.254: v50.09,8.26 53.34,8.21 | ICSP.4 53.34,9.02 | 53.34,9.02 53.34,8.38 | JP9.1 53.34,9.02
N$1
  Top 0.406: 25.67,4.32 25.54,4.52
N$2
  Top 0.254: RN2.3 33.92,11.91 TX.A
N$3
  Top 0.254: ON.A 25.4,12.19 26.29,13.34 29.84,13.34 31.62,10.8 31.62,9.58 33.09,9.58 RN2.1
N$4
  Top 0.152: 29.72,7.14 C12.+
  Top 1.016: R5.1 29.72,7.14
N$5
  Top 0.254: RN2.4 35.04,12.56 RX.A
RD+
  Top 0.203: R2.2 15.47,13.21 15.73,14.23 30.11,14.23 30.73,13.72 33.83,13.72 34.42,14.61 34.92,14.61 35.59,15.37 35.59,16.4 U1.4
RD-
  Top 0.203: R3.2 15.75,14.73 30.61,14.73 30.99,14.35 33.76,14.35 34.27,15.11 34.67,15.11 35.08,15.5 35.08,16.39 U1.3
RESET
  Top 0.203: U1.13 40.32,17.69 40.42,17.66 41.85,16.16 42.28,16.04 44.32,13.97 45.72,12.57 46.86,12.57 | 52.35,16.23 56.96,16.23 58.08,11.65 59.66,11.65 R1.1 61.09,10.92 61.59,10.42 61.59,7.11 | 61.59,7.11 61.59,3.68 61.85,3.43 62.23,3.43 RESET.3 | JP13.1 61.59,7.11
  Top 0.254: 52.35,16.23 ICSP.5
  Top 0.305: 46.86,12.57 47.35,13.06 49.58,13.06 50.29,12.19 ICSP.5
  Top 0.406: RESET.3 RESET.4
RXLED
  Top 0.203: U1.8 37.58,15.64 38.23,14.99 38.23,14.23 37.72,13.84 37.72,12.41 RX.C
S5V
  Top 0.406: 70.87,17.15 SJ1.1
  Top 1.016: JP1.2 66.04,17.27 67.06,17.27 68.33,18.54 JP6.2 70.48,19.81 JP4.2 71.12,18.92 70.87,18.67 70.87,17.15
SCK  (via drill 0.28 pad 0.56)
  Top 0.203: v45.34,9.91 45.29,10.31 43.94,11.69 41,14.63 39.24,14.63 38.08,15.75 38.08,16.41 U1.9
  Top 0.305: ICSP.3 JP8.1
  Bottom 0.203: v45.34,9.91 45.72,9.91 46.1,9.53 48.9,9.53 50.29,10.92 52.07,10.92
  Bottom 0.305: 52.07,10.92 ICSP.3
TXLED  (via drill 0.28 pad 0.56)
  Top 0.203: U1.22 41.73,22.18 42.39,22.79 43.38,22.79 v43.87,23.2 | v41.4,10.54 TX.C
  Bottom 0.203: v43.87,23.2 44.11,23.2 43.81,23.12 48.01,23.12 50.04,20.96 50.04,15.5 48.9,14.35 45.09,14.35 v41.4,10.54
UCAP
  Top 0.203: 36.58,14.86 U1.6
  Top 0.254: C7.1 36.58,14.86
VIN  (via drill 0.28 pad 0.56, 0.51 pad 1.02)
  Top 1.016: 24.11,7.34 25.58,7.34 C10.+ | IC1.1 24.11,7.34 | 24.11,7.34 v24.13,7.24 | v37.85,7.24 47.12,7.24 | 47.12,7.24 48.26,6.22 J8.7 | J8.7 J3.7 | J8.7 J8.8 J3.8 | 47.12,7.24 47.12,9.91 v47.88,10.67 | J1.PWR 11.3,7.07
  Top 1.27: 11.3,7.07 D1.C 15.37,3.3 19.3,7.33 IC1.1
  Bottom 0.203: 53.47,27.31 JP2.4
  Bottom 1.016: v24.13,7.24 v37.85,7.24 | v47.88,10.67 47.88,11.94 55.5,19.56 55.5,26.29 54.48,27.31 53.47,27.31 | JP2.4 JP2.3 JP2.2 JP2.1
VUSB  (via drill 0.28 pad 0.56)
  Top 0.203: 37.08,16.41 37.08,15.11 v37.44,14.63 | U1.2 34.57,16.32 34.58,15.66 33.87,15.56 33.35,15.24 v33.4,15.24 33.02,14.86 | 17.02,15.24 16.76,15.24 | 11.82,20.13 CN1.VBUS
  Top 0.254: U1.7 37.08,16.41 | 4.14,24.79 4.07,25.93 F1.2 | 33.02,14.86 31.37,14.86 30.99,15.24 17.02,15.24 | 16.76,15.24 12.57,19.43 11.82,20.13
  Top 0.508: CN1.VBUS 7.56,20.17 7.56,20.79 6.26,22.09 4.94,24.68 4.14,24.79 | F1.2 4.06,24.89 C9.2
  Bottom 0.203: v37.44,14.63 36.83,15.24 v33.4,15.24 33.27,15.24
XTAL1
  Top 0.203: U1.17 40.39,19.69
  Top 0.254: 40.39,19.69 41.27,19.56 45.21,19.56 45.59,19.94 C4.1 46.8,19.78 47.37,19.52 47.37,19.31 48.6,18.45 Q1.3
XTAL2
  Top 0.203: U1.16 40.38,19.19
  Top 0.254: 40.38,19.19 41.53,18.92 45.04,18.92 45.08,17.74 Q1.1 46.46,16.8 C3.2

### Text on the board
tPlace: + | + | + | + | 6V
tNames: 1
200bmp: r1.1